# Altium schematic sheet Nano_Particle_Breakout.SchDoc: eLFL Nano-to-Particle Breakout
size A; Author: Christian Martinez; CompanyName: eLFL; Organization: WEMPEC; SheetNumber: 1; SheetTotal: 1
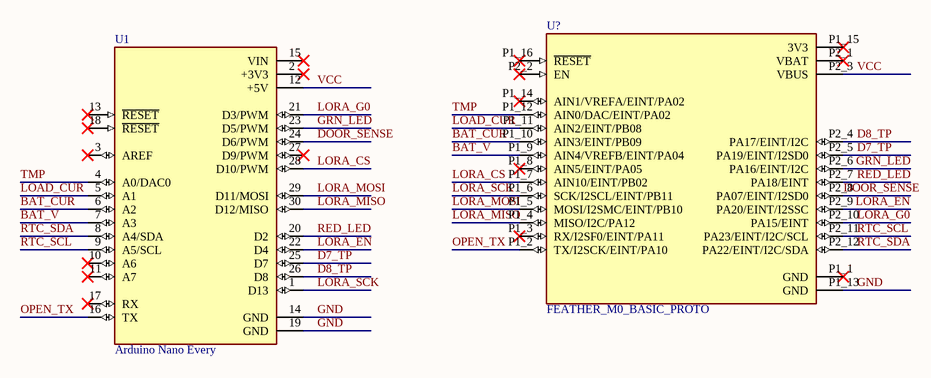
[diagram p0: Nano_Particle_Breakout.SchDoc]

## Parts
U1  Arduino Nano Every  [Arduino Plug]
U?  FEATHER_M0_BASIC_PROTO  [Particle_Module]

## Nets
BAT_CUR: U1.6(A2) U?.P1_10(AIN3/EINT/PB09)
BAT_V: U1.7(A3) U?.P1_9(AIN4/VREFB/EINT/PA04)
D7_TP: U1.25(D7) U?.P2_5(PA19/EINT/I2SD0)
D8_TP: U1.26(D8) U?.P2_4(PA17/EINT/I2C)
DOOR_SENSE: U1.24(D6/PWM) U?.P2_8(PA07/EINT/I2SD0)
GND: U1.14(GND) U1.19(GND) U?.P1_13(GND)
GRN_LED: U1.23(D5/PWM) U?.P2_6(PA16/EINT/I2C)
LOAD_CUR: U1.5(A1) U?.P1_11(AIN2/EINT/PB08)
LORA_CS: U1.28(D10/PWM) U?.P1_7(AIN10/EINT/PB02)
LORA_EN: U1.22(D4) U?.P2_9(PA20/EINT/I2SSC)
LORA_G0: U1.21(D3/PWM) U?.P2_10(PA15/EINT)
LORA_MISO: U1.30(D12/MISO) U?.P1_4(MISO/I2C/PA12)
LORA_MOSI: U1.29(D11/MOSI) U?.P1_5(MOSI/I2SMC/EINT/PB10)
LORA_SCK: U1.1(D13) U?.P1_6(SCK/I2SCL/EINT/PB11)
OPEN_TX: U1.16(TX) U?.P1_2(TX/I2SCK/EINT/PA10)
RED_LED: U1.20(D2) U?.P2_7(PA18/EINT)
RTC_SCL: U1.9(A5/SCL) U?.P2_11(PA23/EINT/I2C/SCL)
RTC_SDA: U1.8(A4/SDA) U?.P2_12(PA22/EINT/I2C/SDA)
TMP: U1.4(A0/DAC0) U?.P1_12(AIN0/DAC/EINT/PA02)
VCC: U1.12(+5V) U?.P2_3(VBUS)

Not connected (* = marked no-connect by the designer): U1 2(+3V3)* 3(AREF)* 10(A6)* 11(A7)* 13(~{RESET})* 15(VIN)* 17(RX)* 18(~{RESET})* 27(D9/PWM)*; U? P1_1(GND)* P1_3(RX/I2SF0/EINT/PA11)* P1_8(AIN5/EINT/PA05)* P1_14(AIN1/VREFA/EINT/PA02)* P1_15(3V3)* P1_16(~{RESET})* P2_1(VBAT)* P2_2(EN)*

## Library data of the parts
U1 = ABX00028: ATmega4809 Arduino Nano Every AVR AVR MCU 8-Bit Embedded Evaluation Board; MF: {'manufacturer': u'Arduino'}; Package: None; MP: ABX00028; Value: *; Availability: Unavailable; Price: None
U? = FEATHER_M0_BASIC_PROTO: ATSAMD21G18 Feather M0 Basic Proto SAM D ARMÂ® CortexÂ®-M0+ MCU 32-Bit Embedded Evaluation Board; MF: {'manufacturer': u'Adafruit Industries'}; Package: None; Value: *; MP: FEATHER_M0_BASIC_PROTO; Availability: Unavailable; Price: None